# Altium schematic sheet stv_bypass.SchDoc: Bluebell MFG PCB
size C; Author: AM; CompanyName: Cambridge Mobile Telematics; DrawnBy: A.Marles; Engineer: DM; Organization: Silver Bullet Technology; Address1: Schematic; Address2: 101 Main Street, 14th Floor; Address3: Cambridge, MA 02142; Address4: USA; DocumentNumber: BLUEBELL-POD; SheetNumber: 2; SheetTotal: 3
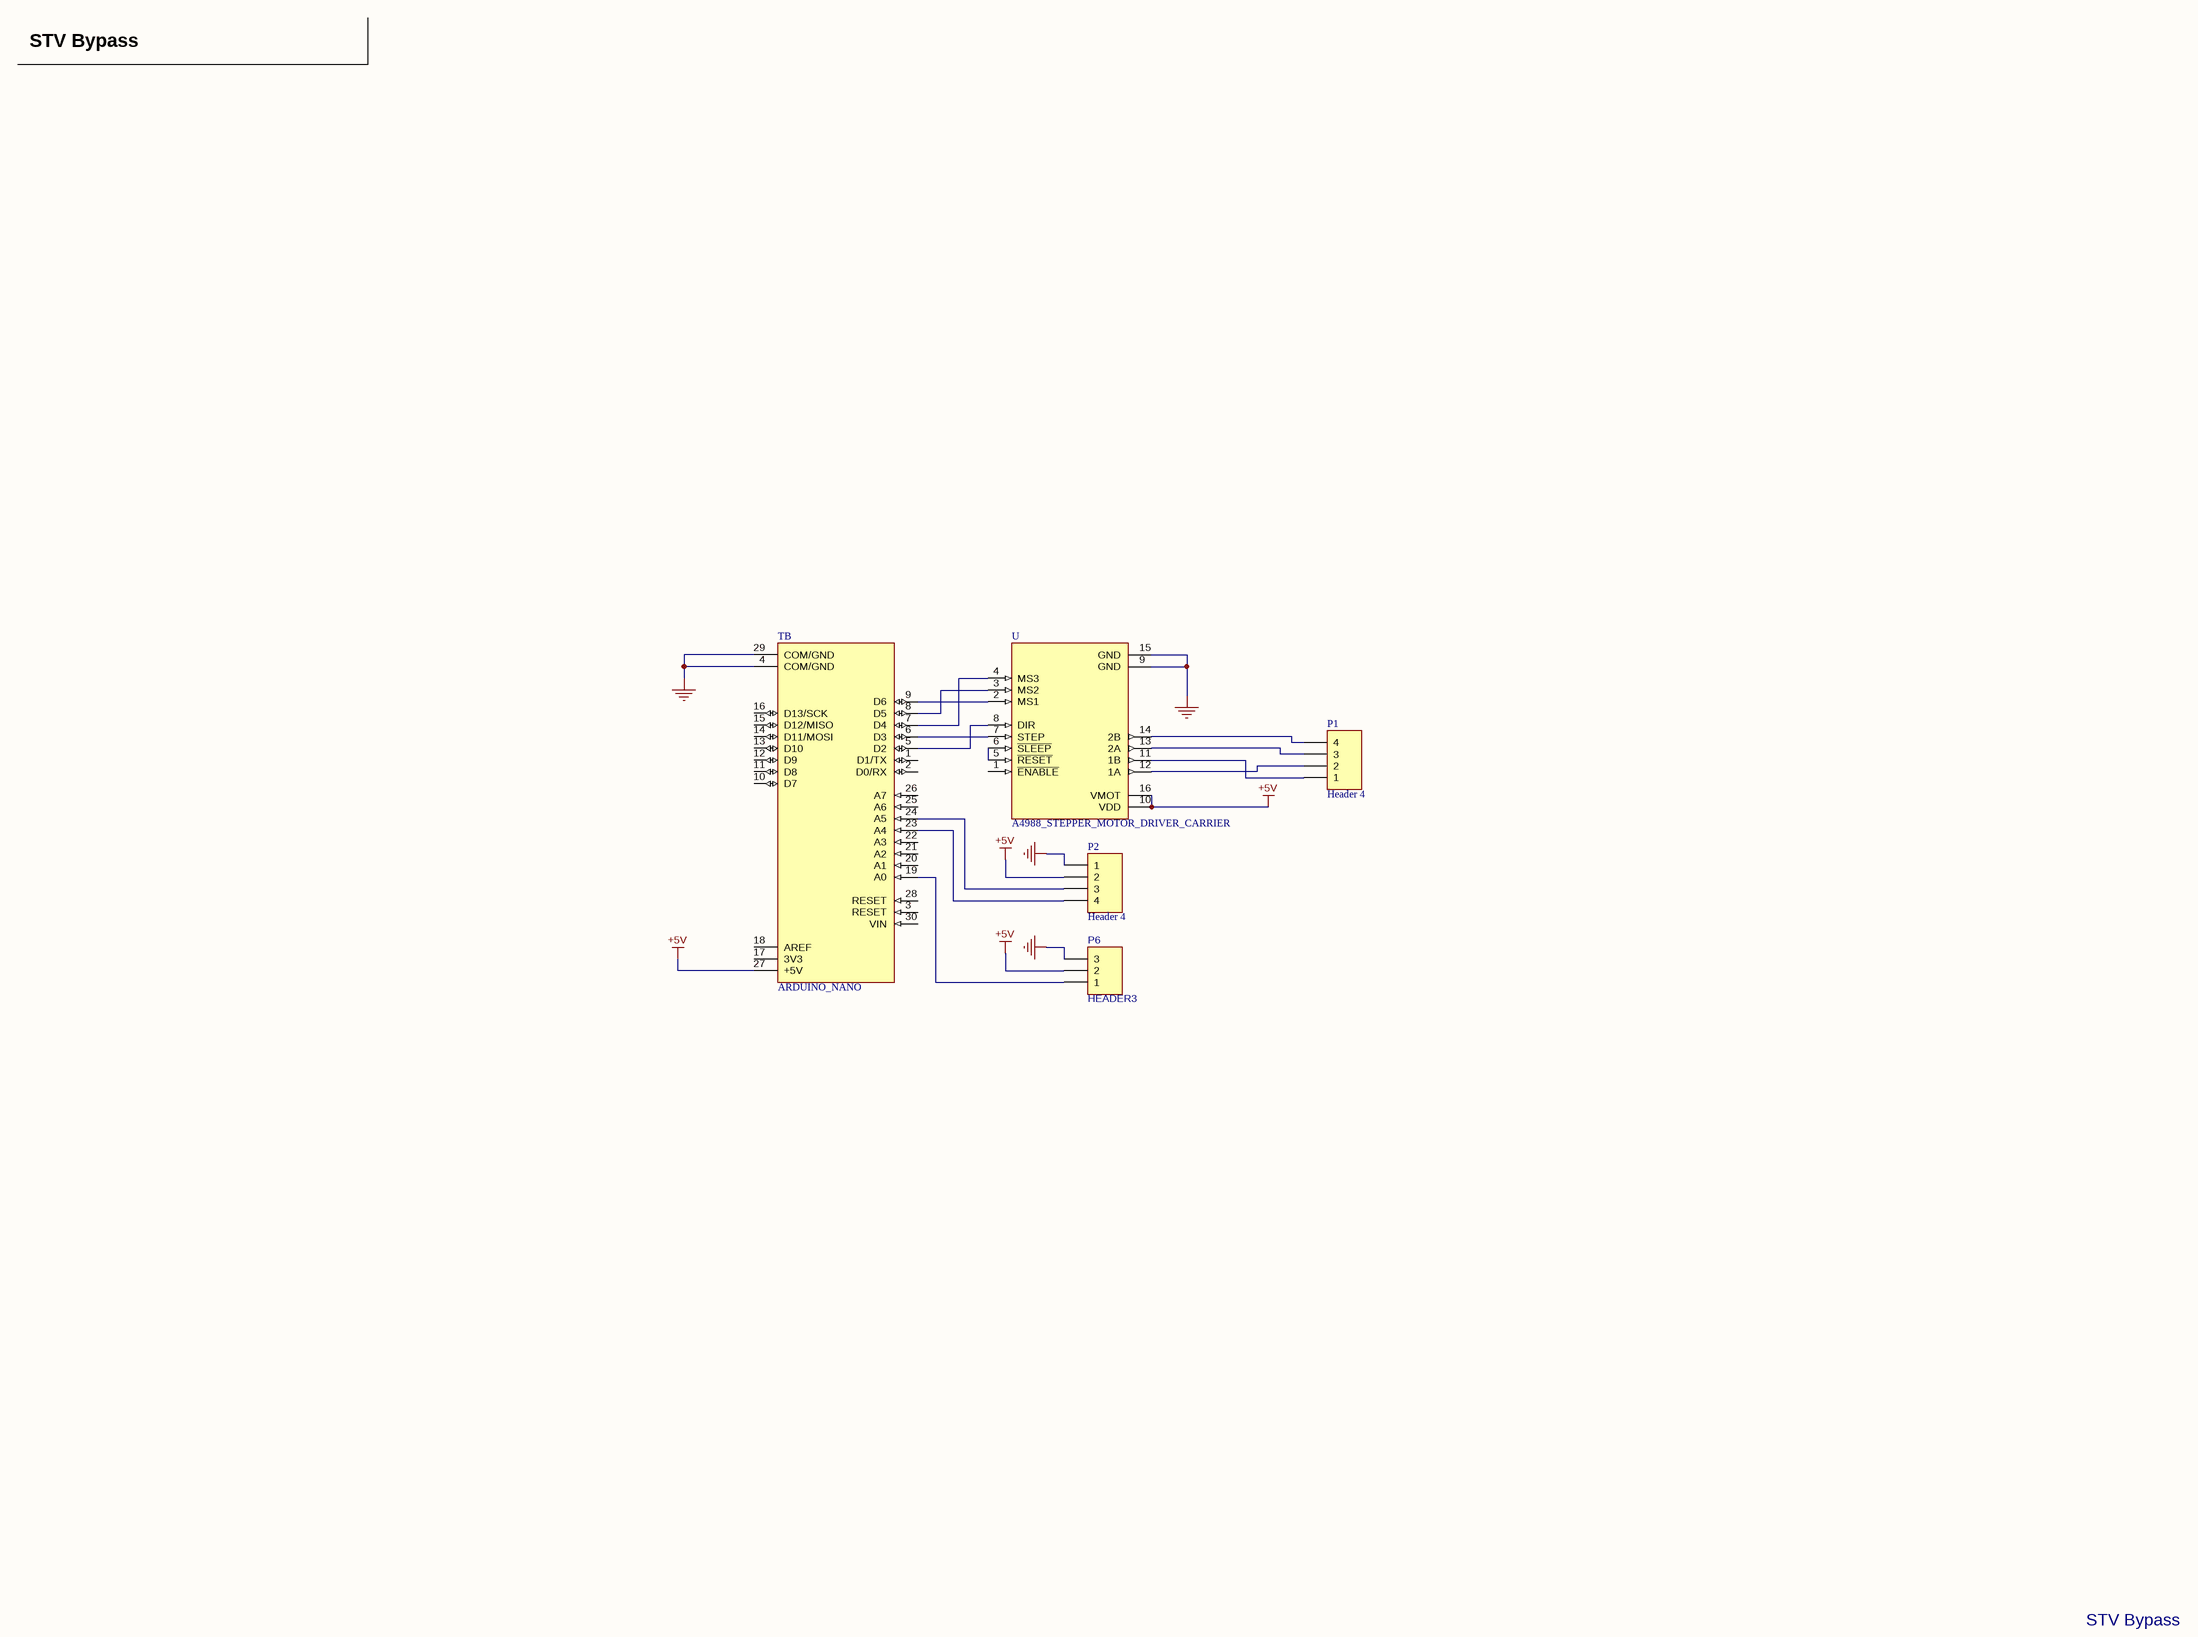
[diagram p0: stv_bypass.SchDoc]

## Parts
P1  Header 4  [HDR1X4]
P2  Header 4  [HDR1X4]
P6  HEADER3  [HDR1X3]
TB  ARDUINO_NANO  [SHIELD_ARDUINO_NANO]
U  A4988_STEPPER_MOTOR_DRIVER_CARRIER  [MODULE_A4988_STEPPER_MOTOR_DRIVER_CARRIER]

## Nets
+5V: P2.2 P6.2 TB.27(+5V) U.10(VDD) U.16(VMOT)
GND: P2.1 P6.3 TB.4(COM/GND) TB.29(COM/GND) U.9(GND) U.15(GND)
NetP1_1: P1.1 U.11(1B)
NetP1_2: P1.2 U.12(1A)
NetP1_3: P1.3 U.13(2A)
NetP1_4: P1.4 U.14(2B)
NetP2_3: P2.3 TB.24(A5)
NetP2_4: P2.4 TB.23(A4)
NetP6_1: P6.1 TB.19(A0)
NetTB_5: TB.5(D2) U.8(DIR)
NetTB_6: TB.6(D3) U.7(STEP)
NetTB_7: TB.7(D4) U.4(MS3)
NetTB_8: TB.8(D5) U.3(MS2)
NetTB_9: TB.9(D6) U.2(MS1)
NetU_5: U.5(~{RESET}) U.6(~{SLEEP})

Not connected (* = marked no-connect by the designer): TB 1(D1/TX) 2(D0/RX) 3(RESET) 10(D7) 11(D8) 12(D9) 13(D10) 14(D11/MOSI) 15(D12/MISO) 16(D13/SCK) 17(3V3) 18(AREF) 20(A1) 21(A2) 22(A3) 25(A6) 26(A7) 28(RESET) 30(VIN); U 1(~{ENABLE})

## Notes on the sheet
- STV Bypass
- Cambridge Mobile Telematics
- SHEET
- PROJECT
- REV
- 101 MAIN STREET, 14TH FLOOR
- CAMBRIDGE, MA 02142
- PHONE: (617) 751-4141
- EMAIL: INFO@CMTELEMATICSCOM
- SIZE
- ENGR
- C
- MODIFIED
- DOCUMENT
- /
- This document contains confidential and proprietary information. No disclosure, reproduction, or transfer of this material in part or in its entirety shall be done without prior written approval.

## Library data of the parts
P1 P2 = Header 4: Header, 4-Pin; LatestRevisionDate: 17-Jul-2002; LatestRevisionNote: Re-released for DXP Platform.; Publisher: Altium Limited
P6 = HEADER-3_1: CONN HEADER MALE 3POS .1" GOLD; Manufacturer 1: Sullins; Manufacturer Part Number 1: PBC03SAAN; Value: HEADER3; Supplier 1: Digi-Key; Supplier Part Number 1: S1011E-03-ND
TB = ARDUINO_NANO: ATSAMD21G18A Arduino Nano 33 IoT SAM D ARMÂ® CortexÂ®-M0+ MCU 32-Bit Embedded Evaluation Board; MP: ARDUINO NANO; Package: None; Price: None; Availability: Unavailable; Value: *; MF: Arduino; SnapEDA_Link: https://www.snapeda.com/parts/ARDUINO%20NANO/Arduino/view-part/1128261/?ref=snap
U = A4988_STEPPER_MOTOR_DRIVER_CARRIER: Stepper Motor Driver; MP: A4988 STEPPER MOTOR DRIVER CARRIER; MF: Pololu; Availability: Unavailable; Price: None; Package: None; Value: *; SnapEDA_Link: https://www.snapeda.com/parts/A4988%20STEPPER%20MOTOR%20DRIVER%20CARRIER/Pololu/view-part/1499394/?ref=snap